# EAGLE design Max756Breakout (EAGLE 6.3)
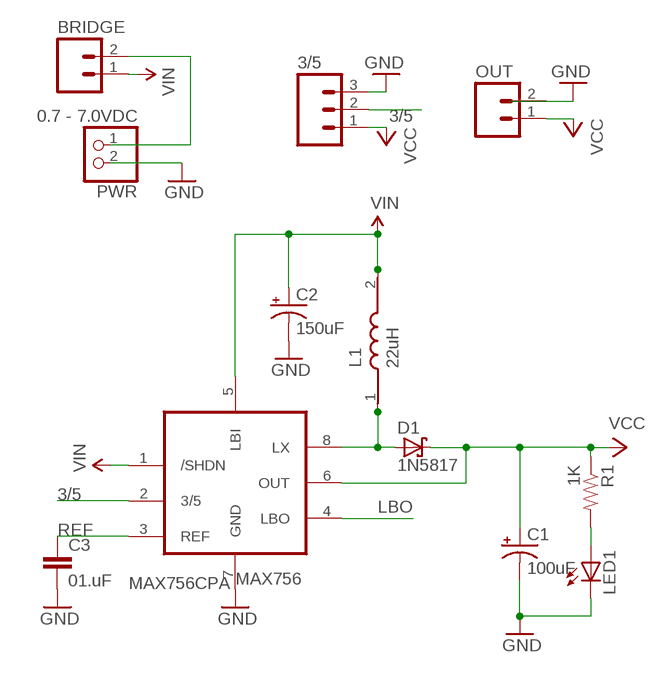
[diagram p0: schematic, sheet 1]

## Parts
3/5  M03LOCK  [1X03_LOCK]
BRIDGE  M02LOCK  [1X02_LOCK]
C1  100uF  CAP_POLPTH2  [CPOL-RADIAL-10UF-25V]
C2  150uF  CAP_POLPTH2  [CPOL-RADIAL-10UF-25V]
C3  01.uF  CAPPTH2  [CAP-PTH-SMALL2]
D1  1N5817  SCHOTTKY-DIODEF126Z12  [F126Z12]
L1  22uH  82114R  [82114R]
LED1  LED3MM  [LED3MM]
MAX756  MAX756CPA  [DIL08]
OUT  M02LOCK  [1X02_LOCK]
PWR  0.7 - 7.0VDC  JST_2PIN-THM-RA  [JST-PH-2-THM-RA]
R1  1K  RESISTORAXIAL-0.2  [AXIAL-0.2]

## Nets
3/5: 3/5.2 MAX756.2(3/5)
GND [power]: 3/5.3 C1.2(-) C2.2(-) C3.2 LED1.K(C) MAX756.7(GND) OUT.2 PWR.2
L1: D1.A L1.1 MAX756.8(LX)
LBO: MAX756.4(LBO)
N$1 [power]: BRIDGE.2 PWR.1
N$2: LED1.A R1.P$2
REF: C3.1 MAX756.3(REF)
VCC [power]: 3/5.1 C1.1(+) D1.C MAX756.6(OUT) OUT.1 R1.P$1
VIN [power]: BRIDGE.1 C2.1(+) L1.2 MAX756.1(/SHDN) MAX756.5(LBI)

## Library data of the parts
3/5 = SparkFun-Connectors:M03: Header 3 Standard 3-pin 0.1" header. Use with straight break away headers (SKU : PRT-00116), right angle break away headers (PRT-00553), swiss pins (PRT-00743), machine pins (PRT-00117), and female headers (PRT-00115). Molex polarized connector foot print use with SKU : PRT-08232 with associated crimp pins and housings.
BRIDGE OUT = SparkFun-Connectors:M02: Header 2 Standard 2-pin 0.1" header. Use with straight break away headers (SKU : PRT-00116), right angle break away headers (PRT-00553), swiss pins (PRT-00743), machine pins (PRT-00117), and female headers (PRT-00115). Molex polarized connector foot print use with SKU : PRT-08233 with associated crimp pins and housings.
C1 C2 = SparkFun-Capacitors:CAP_POL: Capacitor Polarized These are standard SMD and PTH capacitors. Normally 10uF, 47uF, and 100uF in electrolytic and tantalum varieties. Always verify the external diameter of the through hole cap, it varies with capacity, voltage, and manufacturer. The EIA devices should be standard.
C3 = Dek:CAP: Capacitor Standard 0603 ceramic capacitor, and 0.1" leaded capacitor.
D1 = Dek:SCHOTTKY-DIODE: Schottky Diode
L1 = Dek:82114R: INDUCTOR
LED1 = Dek:LED: LEDs Standard schematic elements and footprints for 5mm, 3mm, 1206, and 0603 sized LEDs. 5mm - Spark Fun Electronics SKU : COM-00529 (and others)
MAX756 = adafruit:MAX756
PWR = Dek:JST_2PIN: JST 2-Pin Connectors of various flavors SMT-RA (S2B-PH-SM4) 4UConnector #17311 SMT (B2B-PH-SM4) THM-RA (S2B-PH) THM (B2B-PH)
R1 = Dek:RESISTOR: Resistor Basic schematic elements and footprints for 0603, 1206, and PTH resistors.

## Net classes
1 power: width 0.305 mm, clearance 0.305 mm

## Board
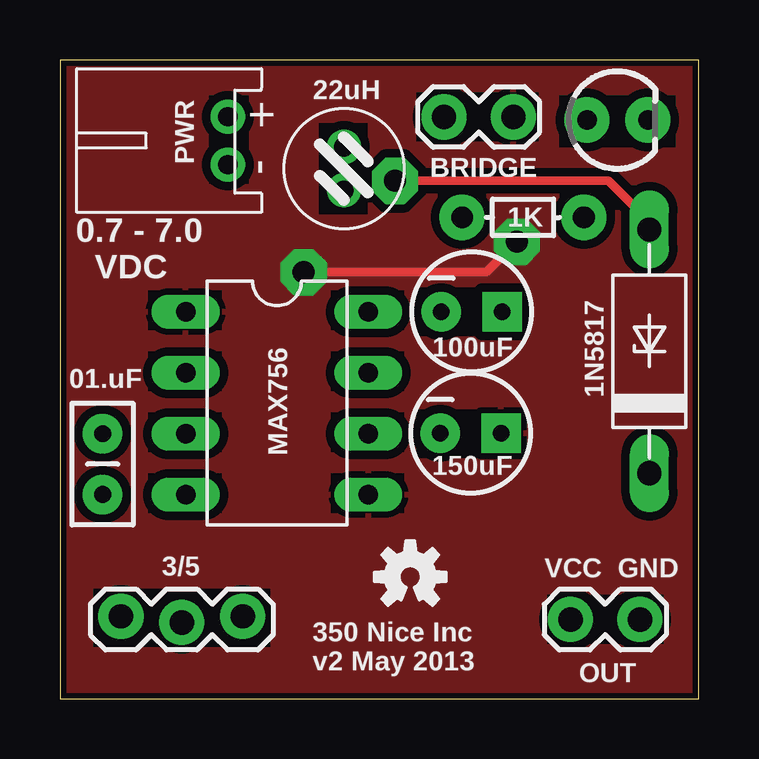
[diagram p1: board, top side]
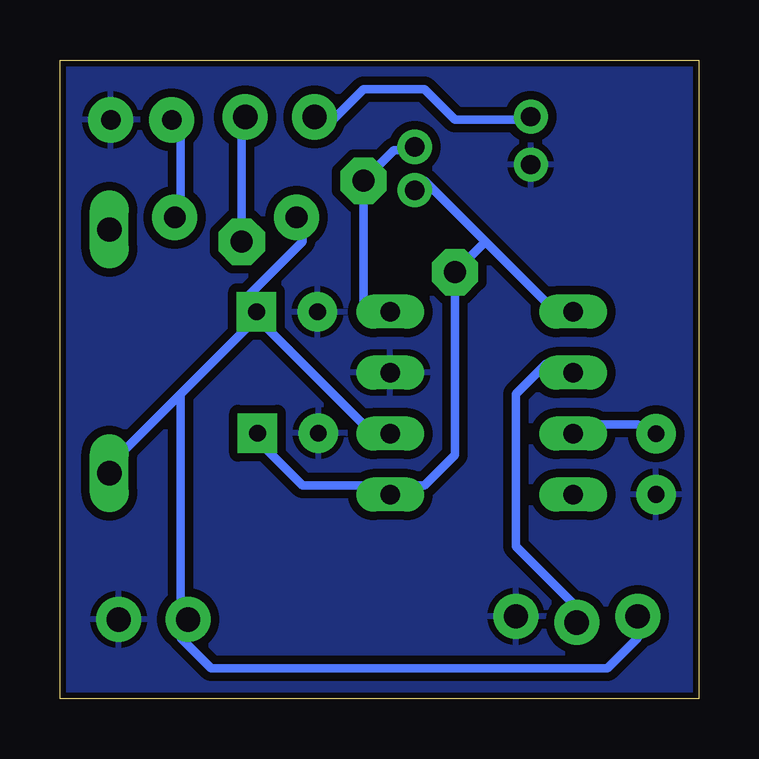
[diagram p2: board, bottom side, seen from below]

Size 26.63 x 26.63 mm. Coordinates in mm from the lower left corner, seen from the top.
Outline: 0,0 26.63,0 26.63,26.63 0,26.63 0,0
Copper layers (1*16): Top 0.035mm / dielectric 1.5mm / Bottom 0.035mm
Design rules "Dek": minimum track width 14mil, minimum drill 36mil, track to track 14mil, track to pad 14mil, pad to pad 14mil, via to via 14mil, smd to smd 0mil, copper to edge 10mil, drill to drill 12mil, minimum pad ring 12mil, minimum via ring 20mil, stop-mask expansion 4mil, vias tented up to drill 25mil, thermal gap 10mil
tRestrict: area 3.7,15.4 to 6.7,17; area 3.7,12.8 to 6.7,14.5; area 3.7,10.3 to 6.7,11.9; area 3.7,7.7 to 6.7,9.4; area 11.3,7.7 to 14.4,9.4; area 11.3,10.3 to 14.4,11.9; area 11.3,12.8 to 14.4,14.5; area 11.3,15.4 to 14.4,17; area 6.2,21.5 to 7.9,25.1; area 14.9,23.2 to 19.9,25.3; area 20.3,2.3 to 25.1,4.3; area 1.4,2.2 to 8.8,4.6; 4 more areas

### Footprints (pad centres in the part's own frame; a part is rotated, then mirrored left to right if it is on the bottom)
1X03_LOCK = drill 1.016 pad 1.88: 1 0,0.127; 2 2.54,-0.127; 3 5.08,0.127
1X02_LOCK = drill 1.016 pad 1.88: 1 -0.178,0; 2 2.718,0
CPOL-RADIAL-10UF-25V = drill 0.7 pad 1.651 square: 1 1.27,0 | drill 0.7 pad 1.651: 2 -1.27,0
CAP-PTH-SMALL2 = drill 0.7 pad 1.651: 1 0,0; 2 2.54,0
F126Z12 = drill 1.016 long: A 5.08,0; C -5.08,0
82114R = drill 0.813: 1 0,0.905; 2 0,-0.905
LED3MM = drill 0.813 pad 1.88: A -1.27,0; K 1.27,0
DIL08 = drill 0.813 long: 1 -3.81,-3.81; 2 -1.27,-3.81; 3 1.27,-3.81; 4 3.81,-3.81; 5 3.81,3.81; 6 1.27,3.81; 7 -1.27,3.81; 8 -3.81,3.81
JST-PH-2-THM-RA = drill 0.8 pad 1.422: 1 1,0; 2 -1,0
AXIAL-0.2 = drill 0.9 pad 1.88: P$1 -2.54,0; P$2 2.54,0

### Placement (x,y rotation side)
3/5  2.54,3.3 0 top
BRIDGE  18.73,24.25 180 top
C1  17.16,16.13 0 top
C2  17.12,11.07 0 top
C3  1.78,11.05 270 top
D1  24.57,14.48 90 top
L1  11.84,22.1 0 top
LED1  23.24,24.13 0 top
MAX756  9.05,12.32 270 top
OUT  21.46,3.3 0 top
PWR  7,23.27 90 top
R1  19.3,20.07 0 top
U$1  [OSHW-LOGO-S]  14.61,5.08 0 top

### Tracks (layer width: path | path; a pad name or v marks a point on that pad's centre or on a via)
3/5
  Bottom 0.356: MAX756.2 6.35,13.97 7.62,12.7 7.62,6.35 5.08,3.81 3/5.2
GND
  pour Bottom: 0,0 0,26.67 27.94,26.67 27.94,0
L1  (via drill 0.91)
  Top 0.356: v13.97,21.59 22.86,21.59 24.13,20.32 D1.A
  Bottom 0.356: MAX756.8 13.97,16.51 v13.97,21.59 12.7,22.86 11.43,22.86 L1.1
N$1
  Bottom 0.356: PWR.1 7.62,24.13 10.16,24.13 11.43,25.4 13.97,25.4 15.24,24.13 BRIDGE.2
N$2
  Bottom 0.356: R1.P$2 21.59,20.32 21.59,24.13 LED1.A
REF
  Bottom 0.356: MAX756.3 5.08,11.43 2.54,11.43 C3.1
VCC
  Bottom 0.356: 3/5.1 2.54,2.54 3.81,1.27 20.32,1.27 21.59,2.54 OUT.1 21.59,3.81 21.59,12.7 | 19.05,16.51 13.97,11.43 MAX756.6 | 21.59,12.7 17.78,16.51 C1.1 19.05,16.51 | 21.59,12.7 24.13,10.16 D1.C | 19.05,16.51 16.51,19.05 16.51,20.32 R1.P$1
VIN  (via drill 0.91)
  Top 0.356: v19.05,19.05 17.78,17.78 v10.16,17.78
  Bottom 0.356: C2.1 19.05,11.43 16.51,8.89 13.97,8.89 MAX756.5 12.7,8.89 11.43,8.89 10.16,10.16 v10.16,17.78 8.89,19.05 | 8.89,19.05 11.43,21.59 L1.2 | 8.89,19.05 6.35,16.51 MAX756.1 | v19.05,19.05 19.05,24.13 BRIDGE.1
  pour Top: 0,0 0,27.94 26.67,27.94 26.67,0

### Text on the board
tPlace: 0.7 - 7.0 / VDC | 350 Nice Inc / v2 May 2013
tNames: VCC | GND